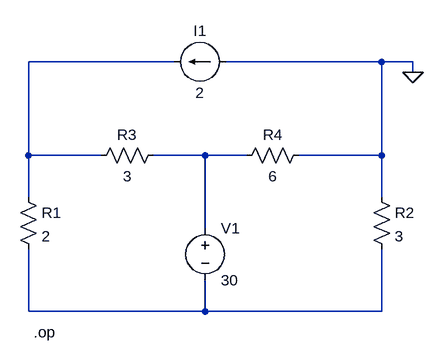
[diagram p0: schematic CH03-KP3-06.asc]
CH03-KP3-06.asc, the LTspice schematic file:
Version 4
SHEET 1 880 680
WIRE 240 112 16 112
WIRE 560 112 320 112
WIRE 608 112 560 112
WIRE 608 128 608 112
WIRE 16 256 16 112
WIRE 128 256 16 256
WIRE 288 256 208 256
WIRE 352 256 288 256
WIRE 560 256 560 112
WIRE 560 256 432 256
WIRE 16 320 16 256
WIRE 560 320 560 256
WIRE 288 368 288 256
WIRE 16 496 16 400
WIRE 288 496 288 448
WIRE 288 496 16 496
WIRE 560 496 560 400
WIRE 560 496 288 496
FLAG 608 128 0
DATAFLAG 64 112 "$"
SYMBOL res 0 304 R0
SYMATTR InstName R1
SYMATTR Value 2
SYMBOL res 544 304 R0
SYMATTR InstName R2
SYMATTR Value 3
SYMBOL res 224 240 R90
WINDOW 0 0 56 VBottom 2
WINDOW 3 32 56 VTop 2
SYMATTR InstName R3
SYMATTR Value 3
SYMBOL res 448 240 R90
WINDOW 0 0 56 VBottom 2
WINDOW 3 32 56 VTop 2
SYMATTR InstName R4
SYMATTR Value 6
SYMBOL voltage 288 352 R0
SYMATTR InstName V1
SYMATTR Value 30
SYMBOL current 320 112 R90
WINDOW 0 -32 40 VBottom 2
WINDOW 3 32 40 VTop 2
SYMATTR InstName I1
SYMATTR Value 2
TEXT 24 528 Left 2 !.op

The netlist it stands for:
* CH03-KP3-06.asc
R1 N001 N003 2
R2 0 N003 3
R3 N002 N001 3
R4 0 N002 6
V1 N002 N003 30
I1 0 N001 2
.op
.backanno
.end